# Altium schematic sheet FPGA-7.SchDoc
size A3; Date: Date; CompanyName: HESSO; Engineer: Name; Address1: Route du Rawyl 47; Address2: 1950 Sion; Address3: Switzerland; ProjectName: Project Name
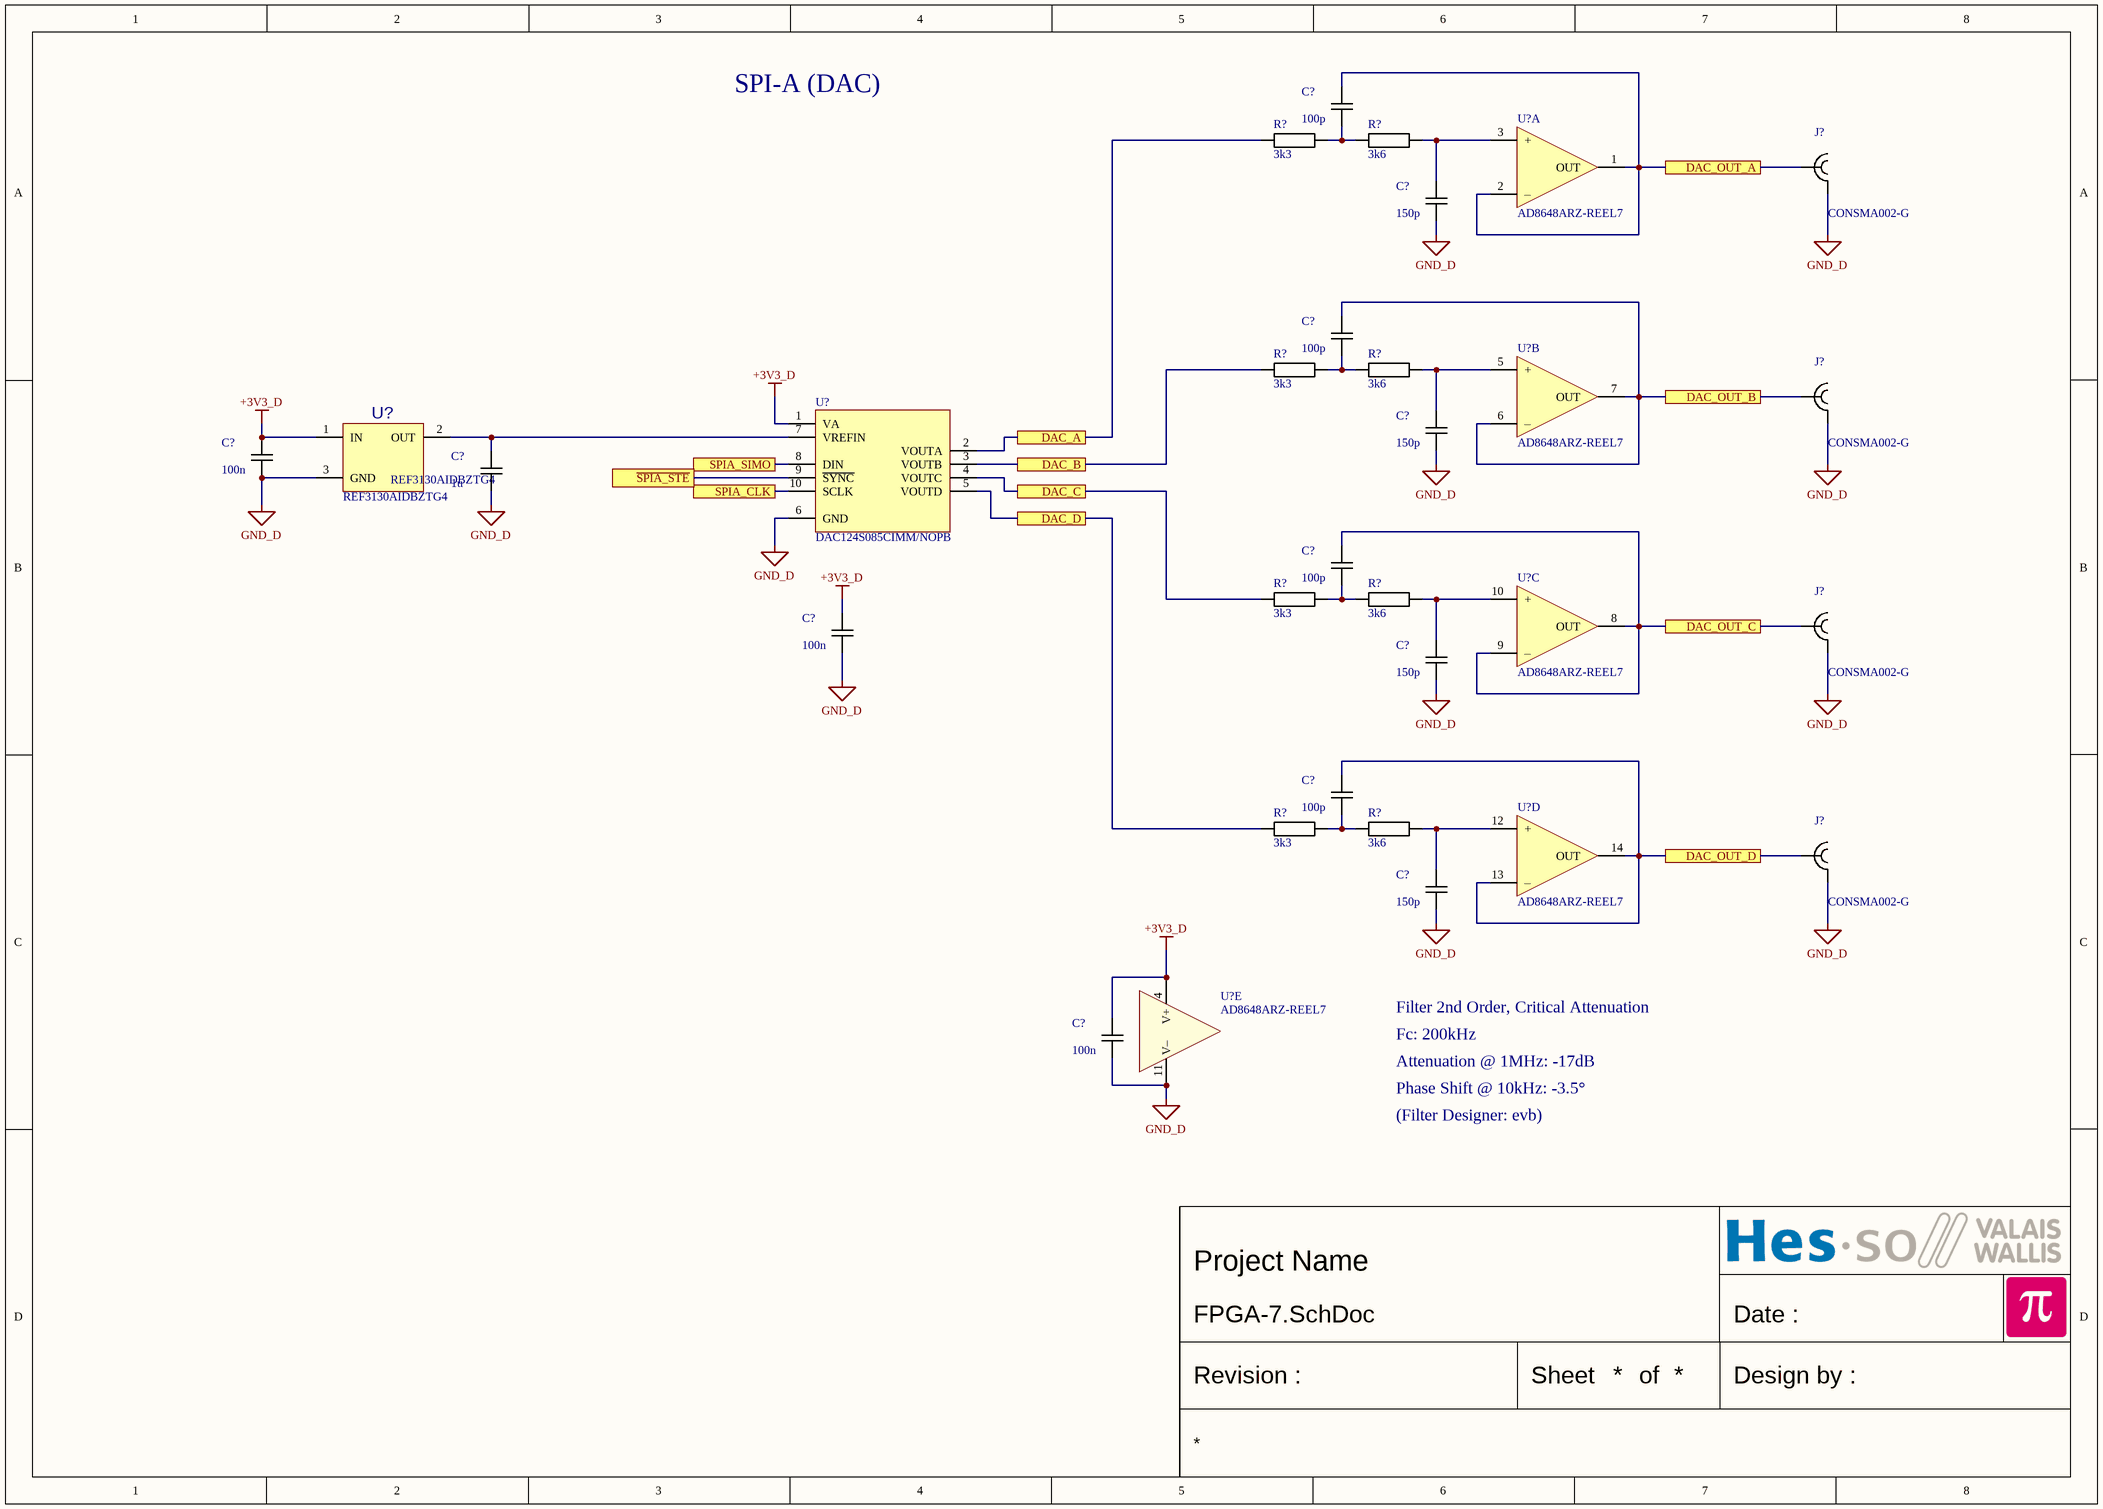
[diagram p0: FPGA-7.SchDoc]

## Parts
(Parts that share a designator on the sheet are numbered #1, #2 ... from top to bottom, then left to right.)
C?#1  100p  [CAPACITOR 2012 REFLOW]
C?#2  150p  [CAPACITOR 2012 REFLOW]
C?#3  100p  [CAPACITOR 2012 REFLOW]
C?#4  150p  [CAPACITOR 2012 REFLOW]
C?#5  100n  [CAPACITOR 2012 REFLOW]
C?#6  1u  [CAPACITOR 2012 REFLOW]
C?#7  100p  [CAPACITOR 2012 REFLOW]
C?#8  100n  [CAPACITOR 1608 REFLOW]
C?#9  150p  [CAPACITOR 2012 REFLOW]
C?#10  100p  [CAPACITOR 2012 REFLOW]
C?#11  150p  [CAPACITOR 2012 REFLOW]
C?#12  100n  [CAPACITOR 1608 REFLOW]
J?#1  CONSMA002-G  [SMA TH Right Angle Linx CONSMA002]
J?#2  CONSMA002-G  [SMA TH Right Angle Linx CONSMA002]
J?#3  CONSMA002-G  [SMA TH Right Angle Linx CONSMA002]
J?#4  CONSMA002-G  [SMA TH Right Angle Linx CONSMA002]
R?#1  3k3  [RESISTOR 2012 REFLOW]
R?#2  3k6  [RESISTOR 2012 REFLOW]
R?#3  3k3  [RESISTOR 2012 REFLOW]
R?#4  3k6  [RESISTOR 2012 REFLOW]
R?#5  3k3  [RESISTOR 2012 REFLOW]
R?#6  3k6  [RESISTOR 2012 REFLOW]
R?#7  3k3  [RESISTOR 2012 REFLOW]
R?#8  3k6  [RESISTOR 2012 REFLOW]
U?#1  AD8648ARZ-REEL7  [SO14 P1.27 C4.0X8.8 H1.75]  (part A of 5)
U?#2  DAC124S085CIMM/NOPB  [VSSOP10 P0.5 C3.1X3.1 H1.1]
U?#3  AD8648ARZ-REEL7  [SO14 P1.27 C4.0X8.8 H1.75]  (part B of 5)
U?#4  REF3130AIDBZTG4  [SOT23 P0.95 C1.6x3.0 H1.3]
U?#5  AD8648ARZ-REEL7  [SO14 P1.27 C4.0X8.8 H1.75]  (part C of 5)
U?#6  AD8648ARZ-REEL7  [SO14 P1.27 C4.0X8.8 H1.75]  (part D of 5)
U?#7  AD8648ARZ-REEL7  [SO14 P1.27 C4.0X8.8 H1.75]  (part E of 5)

## Ports
DAC_A, DAC_B, DAC_C, DAC_D, DAC_OUT_A, DAC_OUT_B, DAC_OUT_C, DAC_OUT_D, SPIA_CLK, SPIA_SIMO, ~{SPIA_STE}

## Nets
+3V3_D: C?#5.2 C?#8.2 C?#12.2 U?#2.1(VA) U?#4.1(IN) U?#7.4(V+)
GND_D: C?#2.1 C?#4.1 C?#5.1 C?#6.1 C?#8.1 C?#9.1 C?#11.1 C?#12.1 J?#1.2 J?#2.2 J?#3.2 J?#4.2 U?#2.6(GND) U?#4.3(GND) U?#7.11(V–)
~{SPIA_STE}: U?#2.9(~{SYNC}) ; port ~{SPIA_STE}
DAC_A: R?#1.1 U?#2.2(VOUTA) ; port DAC_A
DAC_B: R?#3.1 U?#2.3(VOUTB) ; port DAC_B
DAC_C: R?#5.1 U?#2.4(VOUTC) ; port DAC_C
DAC_D: R?#7.1 U?#2.5(VOUTD) ; port DAC_D
DAC_OUT_A: C?#1.2 J?#1.1 U?#1.1(OUT) U?#1.2(–) ; port DAC_OUT_A
DAC_OUT_B: C?#3.2 J?#2.1 U?#3.6(–) U?#3.7(OUT) ; port DAC_OUT_B
DAC_OUT_C: C?#7.2 J?#3.1 U?#5.8(OUT) U?#5.9(–) ; port DAC_OUT_C
DAC_OUT_D: C?#10.2 J?#4.1 U?#6.13(–) U?#6.14(OUT) ; port DAC_OUT_D
SPIA_CLK: U?#2.10(SCLK) ; port SPIA_CLK
SPIA_SIMO: U?#2.8(DIN) ; port SPIA_SIMO
NetC?#1_1: C?#1.1 R?#1.2 R?#2.1
NetC?#2_2: C?#2.2 R?#2.2 U?#1.3(+)
NetC?#3_1: C?#3.1 R?#3.2 R?#4.1
NetC?#4_2: C?#4.2 R?#4.2 U?#3.5(+)
NetC?#6_2: C?#6.2 U?#2.7(VREFIN) U?#4.2(OUT)
NetC?#7_1: C?#7.1 R?#5.2 R?#6.1
NetC?#9_2: C?#9.2 R?#6.2 U?#5.10(+)
NetC?#10_1: C?#10.1 R?#7.2 R?#8.1
NetC?#11_2: C?#11.2 R?#8.2 U?#6.12(+)

## Notes on the sheet
- SPI-A (DAC)
- Filter 2nd Order, Critical Attenuation
- Fc: 200kHz
- Attenuation @ 1MHz: -17dB
- Phase Shift @ 10kHz: -3.5°
- (Filter Designer: evb)
- Date :
- Revision :
- Sheet
- of
- Design by :

## Library data of the parts
C?#1-C?#5 C?#7 C?#9-C?#11 = Capacitor: Capacitor X7R 10% 50V 2012(0805)
  C?#1 C?#3 C?#7 C?#10: Value: 100p
  C?#2 C?#4 C?#9 C?#11: Value: 150p
  C?#5: Value: 100n
C?#6 = Capacitor: Capacitor X7R 10% 10V 2012(0805); Value: 1u
C?#8 C?#12 = Capacitor: Capacitor X7R 10% 50V 1608(0603); Value: 100n
J?#1-J?#4 = SMA TH RIGHT ANGLE LINX CONSMA002: Manufacturer: Linx Technologies; Value: CONSMA002-G; Mouser No.: 712-CONSMA002-G
R?#1-R?#8 = Resistor: Resistor 1% 50V 125mW 2012(0805)
  R?#1 R?#3 R?#5 R?#7: Value: 3k3
  R?#2 R?#4 R?#6 R?#8: Value: 3k6
U?#1 U?#3 U?#5-U?#7 = OPA QUAD: Generic quad OPA 14 pins; Manufacturer: Analog Devices; Value: AD8648ARZ-REEL7; Mouser No.: 584-AD8648ARZ-R7
U?#2 = DAC124S085CIMM: DAC124S085 12-Bit Micro Power Quad Digital-to-Analog Converter With Rail-to-Rail Output; Manufacturer: Texas Instruments; Value: DAC124S085CIMM/NOPB; Mouser No.: 926-DAC124S085CIMMNO
U?#4 = REFERENCE SOT23 IN-OUT- GND: Generic Positive Voltage Reference; Manufacturer: Texas Instruments; Value: REF3130AIDBZTG4; Mouser No.: 595-REF3130AIDBZTG4